# EAGLE schematic Atx_psu (EAGLE 5.10)
REV: 4

## Sheet 1 of 6
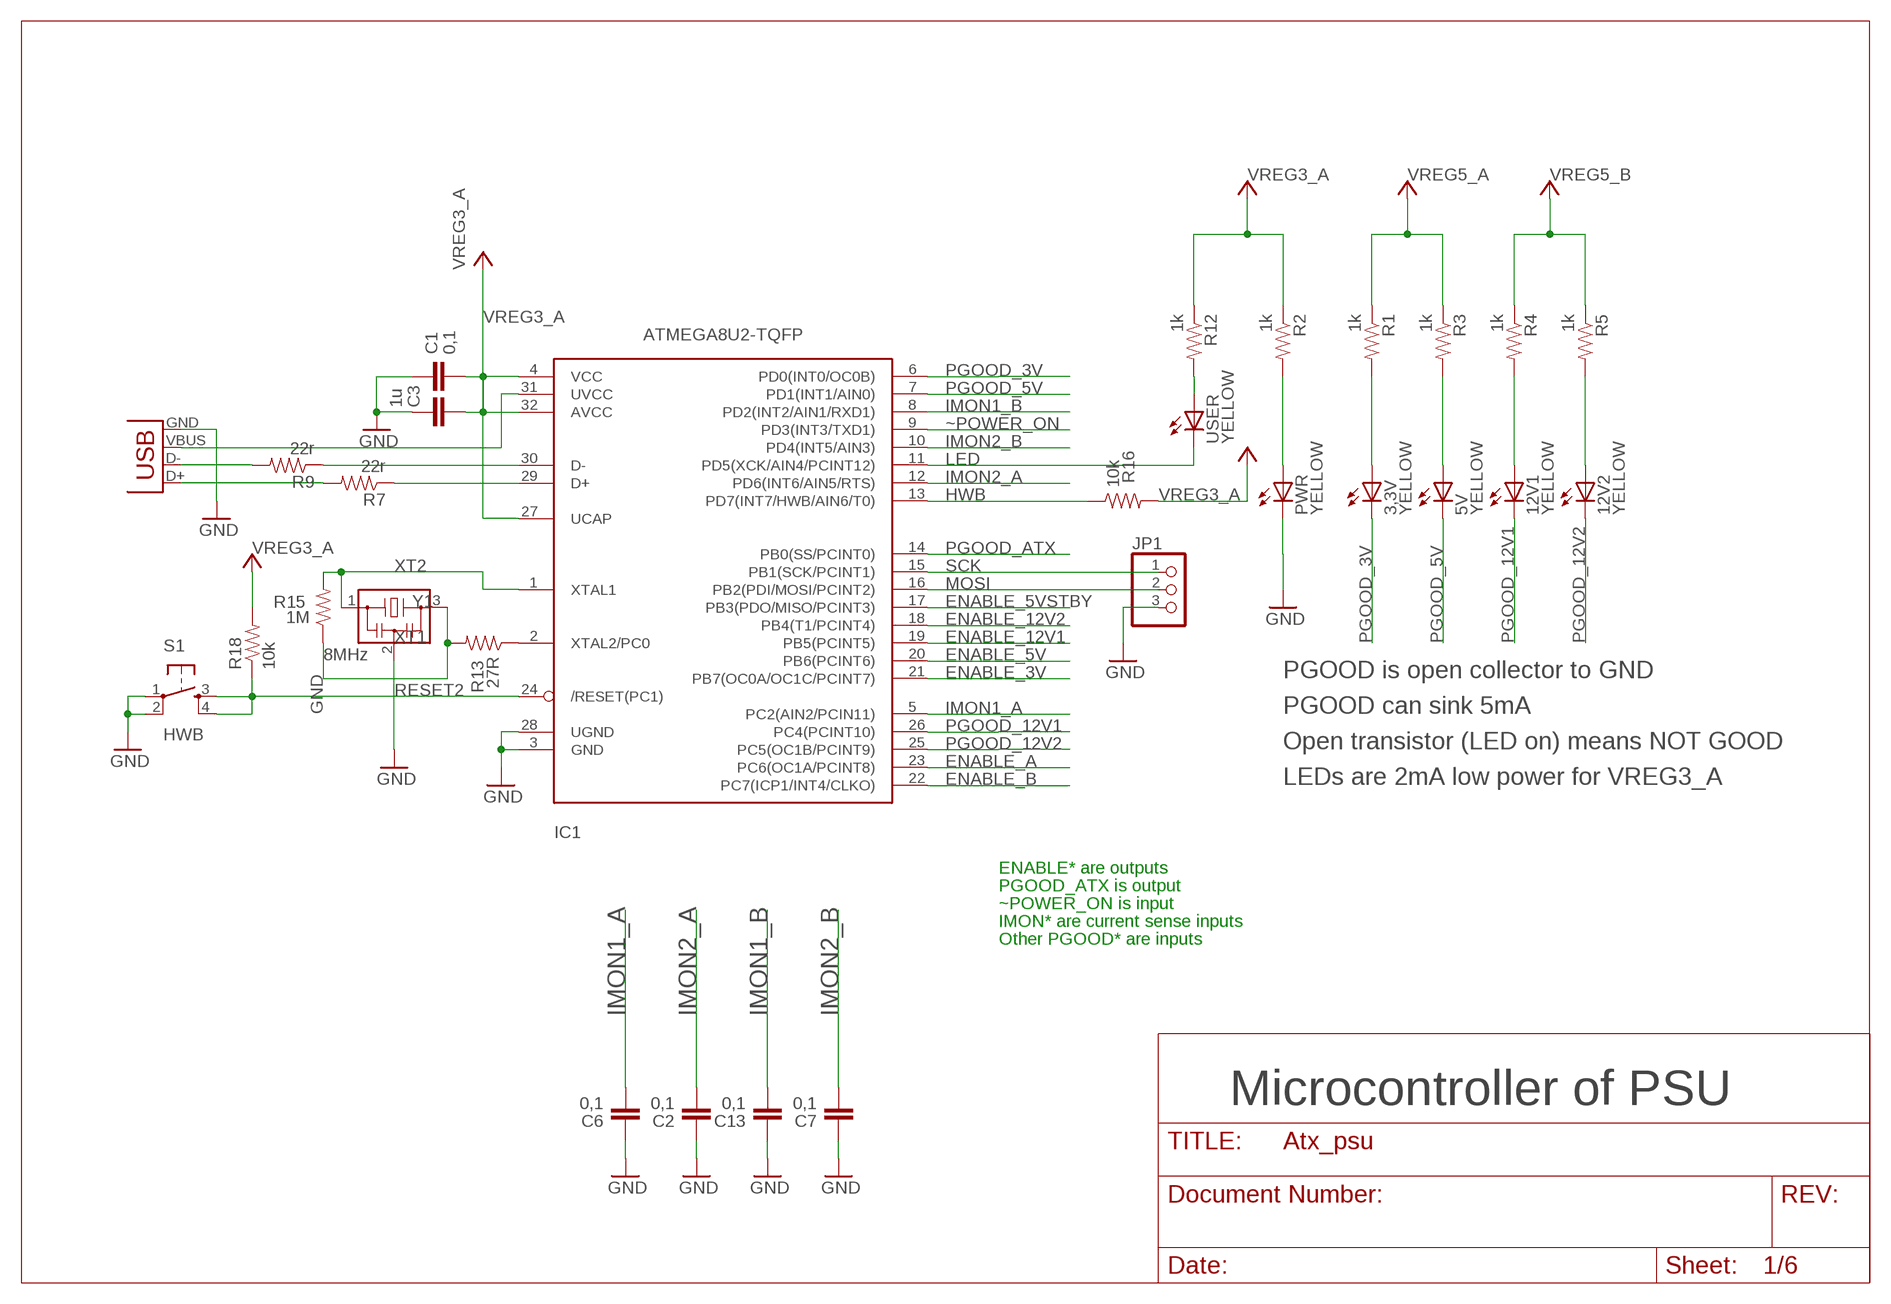
[diagram p0: schematic, sheet 1]

### Parts
3,3V  YELLOW  LEDCHIP-LED0805  [CHIP-LED0805]
5V  YELLOW  LEDCHIP-LED0805  [CHIP-LED0805]
12V1  YELLOW  LEDCHIP-LED0805  [CHIP-LED0805]
12V2  YELLOW  LEDCHIP-LED0805  [CHIP-LED0805]
C1  0,1  C-EUC0805K  [C0805K]
C2  0,1  C-EUC0805K  [C0805K]
C3  1u  C-EUC0805K  [C0805K]
C6  0,1  C-EUC0805K  [C0805K]
C7  0,1  C-EUC0805K  [C0805K]
C13  0,1  C-EUC0805K  [C0805K]
IC1  ATMEGA8U2-TQFP  ATMEGA32U2-TQFP  [TQFP32-08]
JP1  PINHD-1X3  [1X03]
PWR  YELLOW  LEDCHIP-LED0805  [CHIP-LED0805]
R1  1k  RESISTOR  [0805]
R2  1k  RESISTOR  [0805]
R3  1k  RESISTOR  [0805]
R4  1k  RESISTOR  [0805]
R5  1k  RESISTOR  [0805]
R7  22r  RESISTOR  [0805]
R9  22r  RESISTOR  [0805]
R12  1k  RESISTOR  [0805]
R13  27R  RESISTOR  [0805]
R15  1M  RESISTOR  [0805]
R16  10k  RESISTOR  [0805]
R18  10k  RESISTOR  [0805]
S1  HWB  TAC_SWITCHSMD  [TACTILE_SWITCH_SMD]
USER  YELLOW  LEDCHIP-LED0805  [CHIP-LED0805]
X2  USBSMD  [USB-MINIB]
Y1  8MHz  CSTCR6M00G53Z  [CSTCR6M]

### Nets
D+: R7.2 X2.D+
D-: R9.2 X2.D-
ENABLE_3V: IC1.21(PB7(OC0A/OC1C/PCINT7)) ; also sheet 2
ENABLE_5V: IC1.20(PB6(PCINT6)) ; also sheet 2
ENABLE_5VSTBY: IC1.17(PB3(PDO/MISO/PCINT3)) ; also sheet 4
ENABLE_12V1: IC1.19(PB5(PCINT5)) ; also sheet 3
ENABLE_12V2: IC1.18(PB4(T1/PCINT4)) ; also sheet 3
ENABLE_A: IC1.23(PC6(OC1A/PCINT8)) ; also sheet 2
ENABLE_B: IC1.22(PC7(ICP1/INT4/CLKO)) ; also sheet 3
GND: C1.2 C2.2 C3.2 C6.2 C7.2 C13.2 IC1.3(GND) IC1.28(UGND) JP1.3 PWR.C S1.1 S1.2 X2.GND Y1.2 ; also sheet 2,3,6
HWB: IC1.13(PD7(INT7/HWB/AIN6/T0)) R16.1
IMON1_A: C6.1 IC1.5(PC2(AIN2/PCIN11)) ; also sheet 2
IMON1_B: C13.1 IC1.8(PD2(INT2/AIN1/RXD1)) ; also sheet 3
IMON2_A: C2.1 IC1.12(PD6(INT6/AIN5/RTS)) ; also sheet 2
IMON2_B: C7.1 IC1.10(PD4(INT5/AIN3)) ; also sheet 3
LED: IC1.11(PD5(XCK/AIN4/PCINT12)) USER.C
MOSI: IC1.16(PB2(PDI/MOSI/PCINT2)) JP1.2
N$7: PWR.A R2.2
N$9: 3,3V.A R1.2
N$10: 5V.A R3.2
N$11: 12V1.A R4.2
N$14: 12V2.A R5.2
N$25: IC1.2(XTAL2/PC0) R13.1
N$36: R12.2 USER.A
PGOOD_3V: 3,3V.C IC1.6(PD0(INT0/OC0B)) ; also sheet 2
PGOOD_5V: 5V.C IC1.7(PD1(INT1/AIN0)) ; also sheet 2
PGOOD_12V1: 12V1.C IC1.26(PC4(PCINT10)) ; also sheet 3
PGOOD_12V2: 12V2.C IC1.25(PC5(OC1B/PCINT9)) ; also sheet 3
PGOOD_ATX [somepower]: IC1.14(PB0(SS/PCINT0)) ; also sheet 6
RD+: IC1.29(D+) R7.1
RD-: IC1.30(D-) R9.1
RESET2: IC1.24(/RESET(PC1)) R18.1 S1.3 S1.4
SCK: IC1.15(PB1(SCK/PCINT1)) JP1.1
USBVCC: IC1.31(UVCC) X2.VBUS
VREG3_A: C1.1 C3.1 IC1.4(VCC) IC1.27(UCAP) IC1.32(AVCC) R2.1 R12.1 R16.2 R18.2 ; supply symbol labelled +5V_L ; also sheet 2
VREG5_A: R1.1 R3.1 ; supply symbol labelled +5V_L ; also sheet 2
VREG5_B: R4.1 R5.1 ; supply symbol labelled +5V_L ; also sheet 3
XT1: R13.2 R15.1 Y1.3
XT2: IC1.1(XTAL1) R15.2 Y1.1
~POWER_ON [somepower]: IC1.9(PD3(INT3/TXD1)) ; also sheet 6

### Notes on the sheet
- PGOOD is open collector to GND
- PGOOD can sink 5mA
- Open transistor (LED on) means NOT GOOD
- LEDs are 2mA low power for VREG3_A
- ENABLE* are outputs
- PGOOD_ATX is output
- ~POWER_ON is input
- IMON* are current sense inputs
- Other PGOOD* are inputs
- Microcontroller of PSU

## Sheet 2 of 6
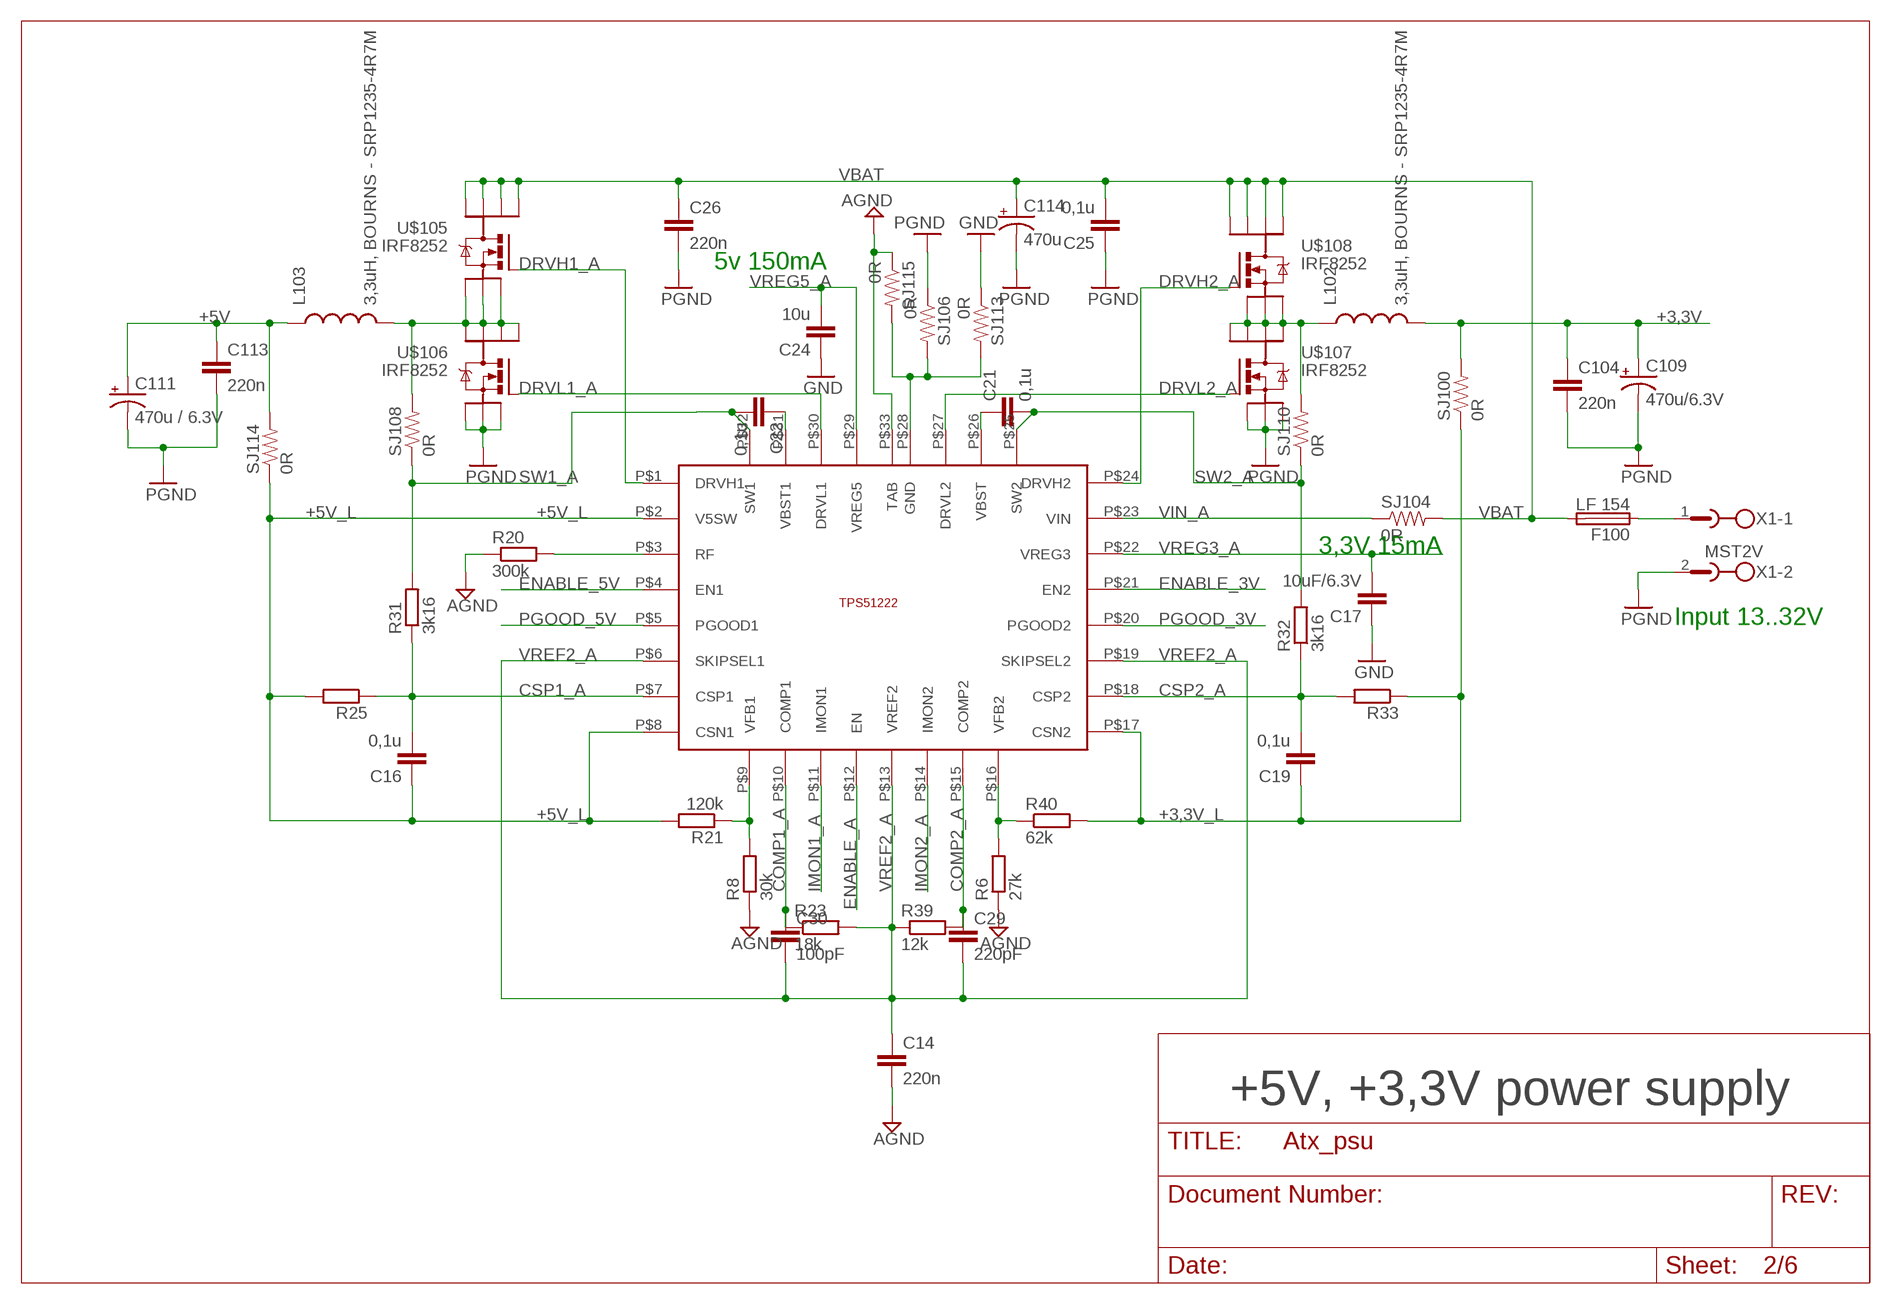
[diagram p1: schematic, sheet 2]

### Parts
C14  220n  C-EUC0603  [C0603]
C16  0,1u  C-EUC0805K  [C0805K]
C17  10uF/6.3V  C-EUC1210  [C1210]
C19  0,1u  C-EUC0805K  [C0805K]
C21  0,1u  C-EUC0805K  [C0805K]
C22  0,1u  C-EUC0805K  [C0805K]
C24  10u  C-EUC1210  [C1210]
C25  0,1u  C-EUC0805  [C0805]
C26  220n  C-EUC0603  [C0603]
C29  220pF  CAP0805  [0805]
C30  100pF  CAP0805  [0805]
C104  220n  C-EUC0805K  [C0805K]
C109  470u/6.3V  CAP_POLH13  [PANASONIC_H13]
C111  470u / 6.3V  CAP_POLH13  [PANASONIC_H13]
C113  220n  C-EUC0805K  [C0805K]
C114  470u  CAP_POLH13  [PANASONIC_H13]
F100  LF 154  FUSE  [OMNI-BLOK]
L102  3,3uH, BOURNS - SRP1235-4R7M  INDUCTORPWR  [CDRH125]
L103  3,3uH, BOURNS - SRP1235-4R7M  INDUCTORPWR  [CDRH125]
R6  27k  R-EU_R0805  [R0805]
R8  30k  R-EU_R0805  [R0805]
R20  300k  R-EU_R0805  [R0805]
R21  120k  R-EU_R0805  [R0805]
R23  18k  R-EU_R0805  [R0805]
R25  R-EU_R0805  [R0805]
R31  3k16  R-EU_R0805  [R0805]
R32  3k16  R-EU_R0805  [R0805]
R33  R-EU_R0805  [R0805]
R39  12k  R-EU_R0805  [R0805]
R40  62k  R-EU_R0805  [R0805]
SJ100  0R  RESISTOR1206  [1206]
SJ104  0R  RESISTOR1206  [1206]
SJ106  0R  RESISTOR1206  [1206]
SJ108  0R  RESISTOR1206  [1206]
SJ110  0R  RESISTOR1206  [1206]
SJ113  0R  RESISTOR1206  [1206]
SJ114  0R  RESISTOR1206  [1206]
SJ115  0R  RESISTOR1206  [1206]
U$2  TPS51222RTVT  [QFN-32]
U$105  IRF8252  [SO8]
U$106  IRF8252  [SO8]
U$107  IRF8252  [SO8]
U$108  IRF8252  [SO8]
X1  MST2V  [MSTBV2]

### Nets
+3,3V [power]: C104.1 C109.+ L102.2 SJ100.2 ; also sheet 6
+3,3V_L: C19.1 R33.1 R40.2 SJ100.1 U$2.P$17(CSN2)
+5V [power]: C111.+ C113.1 L103.1 SJ114.2 ; also sheet 6
+5V_L: C16.1 R21.2 R25.2 SJ114.1 U$2.P$2(V5SW) U$2.P$8(CSN1) ; also sheet 3
AGND: C14.2 R6.1 R8.1 R20.1 SJ115.1 U$2.P$33(TAB) ; also sheet 3
COMP1_A: C30.1 R23.1 U$2.P$10(COMP1)
COMP2_A: C29.1 R39.2 U$2.P$15(COMP2)
CSP1_A: C16.2 R25.1 R31.1 U$2.P$7(CSP1)
CSP2_A: C19.2 R32.1 R33.2 U$2.P$18(CSP2)
DRVH1_A: U$2.P$1(DRVH1) U$105.4(G)
DRVH2_A: U$2.P$24(DRVH2) U$108.4(G)
DRVL1_A: U$2.P$30(DRVL1) U$106.4(G)
DRVL2_A: U$2.P$27(DRVL2) U$107.4(G)
ENABLE_3V: U$2.P$21(EN2) ; also sheet 1
ENABLE_5V: U$2.P$4(EN1) ; also sheet 1
ENABLE_A: U$2.P$12(EN) ; also sheet 1
GND: C17.1 C24.1 SJ113.1 ; also sheet 1,3,6
IMON1_A: U$2.P$11(IMON1) ; also sheet 1
IMON2_A: U$2.P$14(IMON2) ; also sheet 1
N$1: SJ106.2 SJ113.2 SJ115.2 U$2.P$28(GND)
N$2 [power]: L102.1 SJ110.2 U$107.5(D) U$107.6(D) U$107.7(D) U$107.8(D) U$108.1(S) U$108.2(S) U$108.3(S)
N$3: R8.2 R21.1 U$2.P$9(VFB1)
N$4: R6.2 R40.1 U$2.P$16(VFB2)
N$8 [power]: L103.2 SJ108.2 U$105.1(S) U$105.2(S) U$105.3(S) U$106.5(D) U$106.6(D) U$106.7(D) U$106.8(D)
N$16 [power]: F100.1 X1.1
N$24: R20.2 U$2.P$3(RF)
N$29: C22.1 U$2.P$31(VBST1)
N$30: C21.1 U$2.P$26(VBST)
PGND [power]: C25.1 C26.2 C104.2 C109.- C111.- C113.2 C114.- SJ106.1 U$106.1(S) U$106.2(S) U$106.3(S) U$107.1(S) U$107.2(S) U$107.3(S) X1.2 ; also sheet 3,4,5,6
PGOOD_3V: U$2.P$20(PGOOD2) ; also sheet 1
PGOOD_5V: U$2.P$5(PGOOD1) ; also sheet 1
SW1_A: C22.2 R31.2 SJ108.1 U$2.P$32(SW1)
SW2_A: C21.2 R32.2 SJ110.1 U$2.P$25(SW2)
VBAT [power]: C25.2 C26.1 C114.+ F100.2 SJ104.2 U$105.5(D) U$105.6(D) U$105.7(D) U$105.8(D) U$108.5(D) U$108.6(D) U$108.7(D) U$108.8(D) ; also sheet 3,4
VIN_A: SJ104.1 U$2.P$23(VIN)
VREF2_A: C14.1 C29.2 C30.2 R23.2 R39.1 U$2.P$6(SKIPSEL1) U$2.P$13(VREF2) U$2.P$19(SKIPSEL2)
VREG3_A: C17.2 U$2.P$22(VREG3) ; also sheet 1
VREG5_A: C24.2 U$2.P$29(VREG5) ; also sheet 1

### Notes on the sheet
- 5v 150mA
- 3,3V 15mA
- Input 13..32V
- +5V, +3,3V power supply

## Sheet 3 of 6
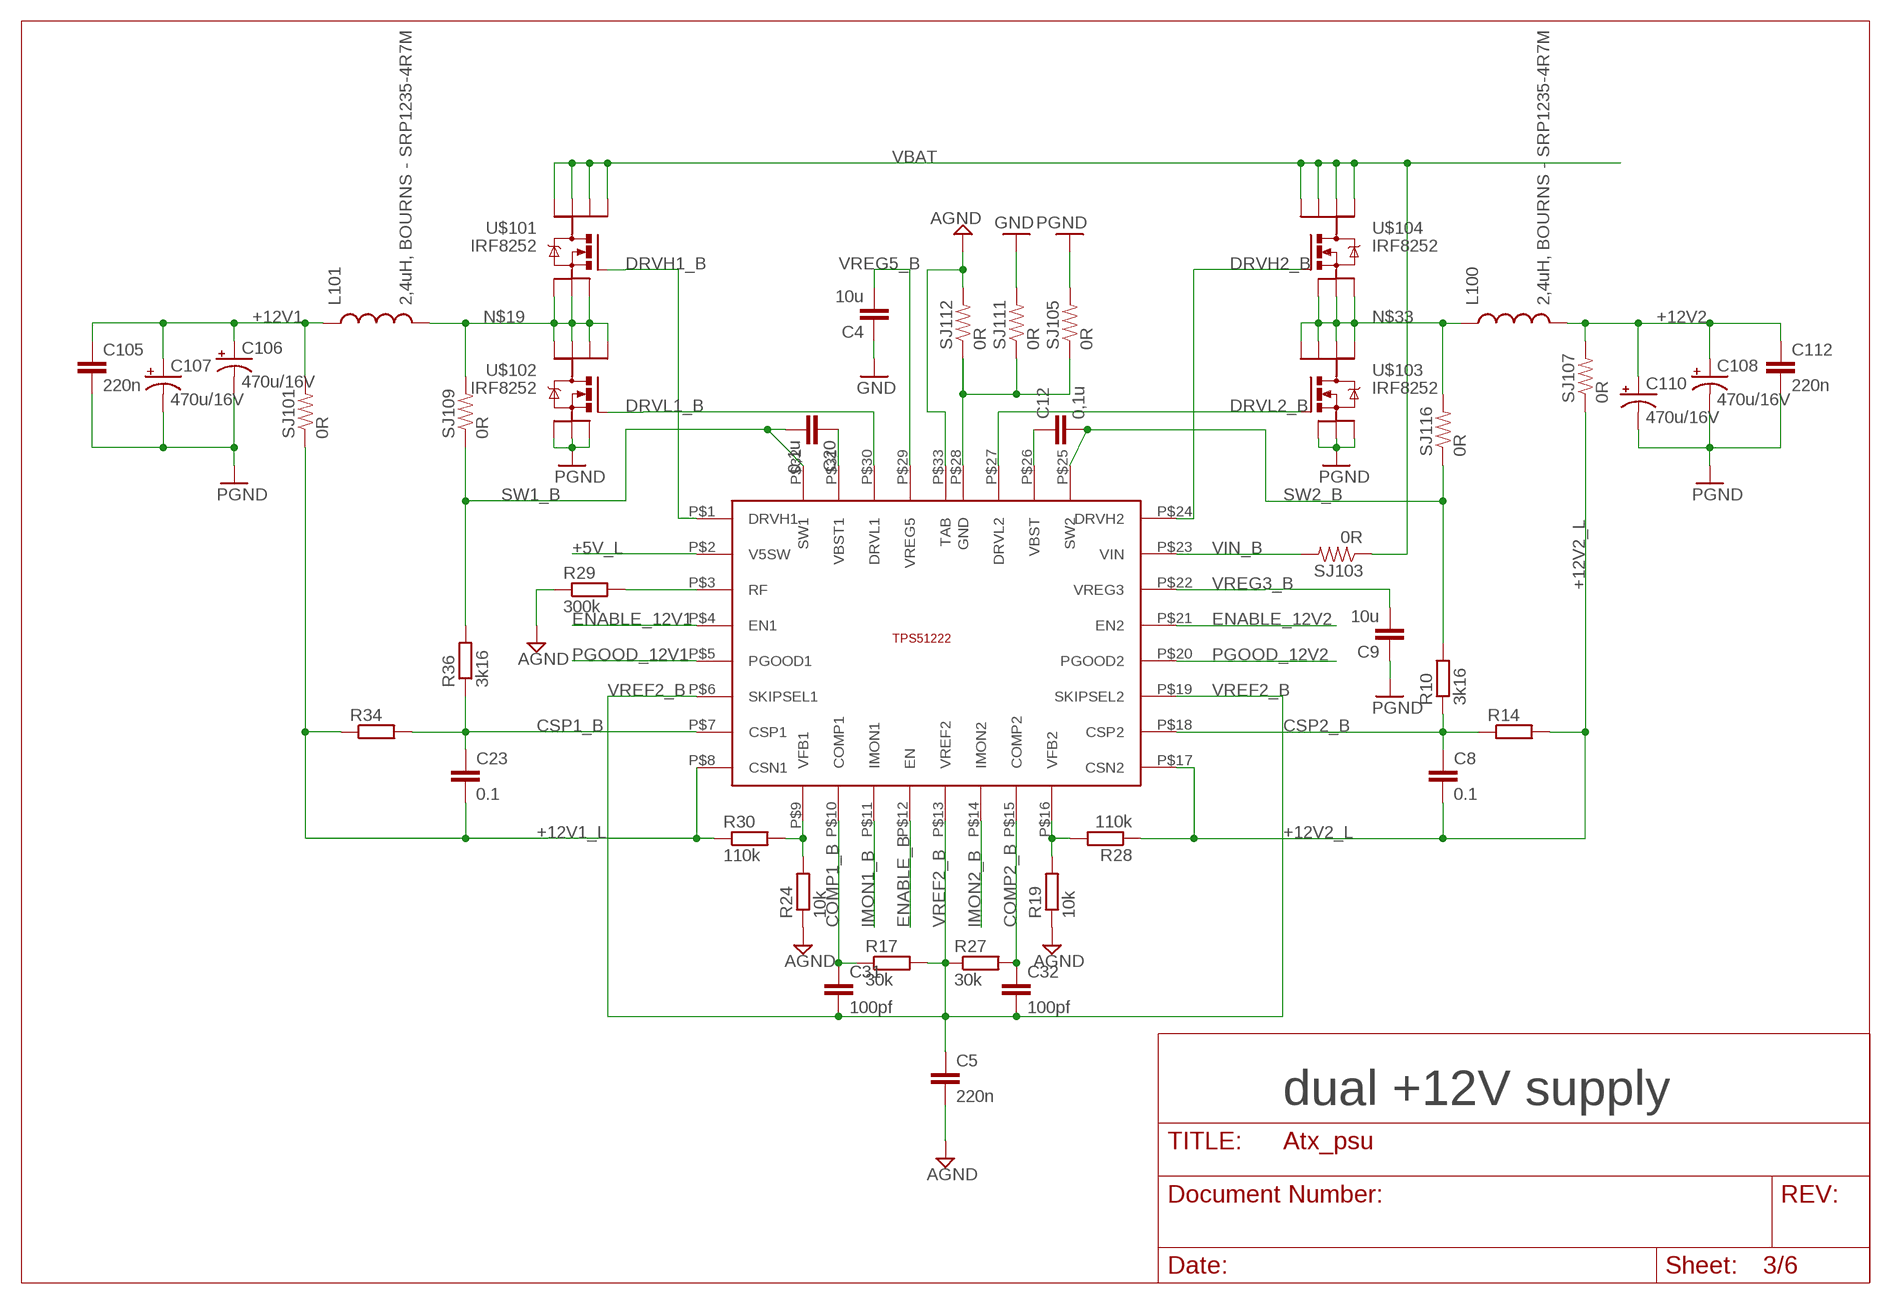
[diagram p2: schematic, sheet 3]

### Parts
C4  10u  C-EUC1210  [C1210]
C5  220n  C-EUC0805K  [C0805K]
C8  0.1  C-EUC0805K  [C0805K]
C9  10u  C-EUC1210  [C1210]
C12  0,1u  C-EUC0805K  [C0805K]
C20  0,1u  C-EUC0805K  [C0805K]
C23  0.1  C-EUC0805K  [C0805K]
C31  100pf  CAP0805  [0805]
C32  100pf  CAP0805  [0805]
C105  220n  C-EUC0805K  [C0805K]
C106  470u/16V  CAP_POLH13  [PANASONIC_H13]
C107  470u/16V  CAP_POLH13  [PANASONIC_H13]
C108  470u/16V  CAP_POLH13  [PANASONIC_H13]
C110  470u/16V  CAP_POLH13  [PANASONIC_H13]
C112  220n  C-EUC0805K  [C0805K]
L100  2,4uH, BOURNS - SRP1235-4R7M  INDUCTORPWR  [CDRH125]
L101  2,4uH, BOURNS - SRP1235-4R7M  INDUCTORPWR  [CDRH125]
R10  3k16  R-EU_R0805  [R0805]
R14  R-EU_R0805  [R0805]
R17  30k  R-EU_R0805  [R0805]
R19  10k  R-EU_R0805  [R0805]
R24  10k  R-EU_R0805  [R0805]
R27  30k  R-EU_R0805  [R0805]
R28  110k  R-EU_R0805  [R0805]
R29  300k  R-EU_R0805  [R0805]
R30  110k  R-EU_R0805  [R0805]
R34  R-EU_R0805  [R0805]
R36  3k16  R-EU_R0805  [R0805]
SJ101  0R  RESISTOR1206  [1206]
SJ103  0R  RESISTOR1206  [1206]
SJ105  0R  RESISTOR1206  [1206]
SJ107  0R  RESISTOR1206  [1206]
SJ109  0R  RESISTOR1206  [1206]
SJ111  0R  RESISTOR1206  [1206]
SJ112  0R  RESISTOR1206  [1206]
SJ116  0R  RESISTOR1206  [1206]
U$1  TPS51222RTVT  [QFN-32]
U$101  IRF8252  [SO8]
U$102  IRF8252  [SO8]
U$103  IRF8252  [SO8]
U$104  IRF8252  [SO8]

### Nets
+5V_L: U$1.P$2(V5SW) ; also sheet 2
+12V1 [power]: C105.1 C106.+ C107.+ L101.1 SJ101.2 ; also sheet 5,6
+12V1_L: C23.2 R30.1 R34.1 SJ101.1 U$1.P$8(CSN1)
+12V2 [power]: C108.+ C110.+ C112.1 L100.2 SJ107.2 ; also sheet 6
+12V2_L: C8.2 R14.2 R28.1 SJ107.1 U$1.P$17(CSN2)
AGND: C5.2 R19.1 R24.1 R29.1 SJ112.2 U$1.P$33(TAB) ; also sheet 2
COMP1_B: C31.1 R17.1 U$1.P$10(COMP1)
COMP2_B: C32.1 R27.2 U$1.P$15(COMP2)
CSP1_B: C23.1 R34.2 R36.1 U$1.P$7(CSP1)
CSP2_B: C8.1 R10.1 R14.1 U$1.P$18(CSP2)
DRVH1_B: U$1.P$1(DRVH1) U$101.4(G)
DRVH2_B: U$1.P$24(DRVH2) U$104.4(G)
DRVL1_B: U$1.P$30(DRVL1) U$102.4(G)
DRVL2_B: U$1.P$27(DRVL2) U$103.4(G)
ENABLE_12V1: U$1.P$4(EN1) ; also sheet 1
ENABLE_12V2: U$1.P$21(EN2) ; also sheet 1
ENABLE_B: U$1.P$12(EN) ; also sheet 1
GND: C4.1 C9.1 SJ111.2 ; supply symbol labelled PGND ; also sheet 1,2,6
IMON1_B: U$1.P$11(IMON1) ; also sheet 1
IMON2_B: U$1.P$14(IMON2) ; also sheet 1
N$12: R29.2 U$1.P$3(RF)
N$13: C20.1 U$1.P$31(VBST1)
N$15: C12.1 U$1.P$26(VBST)
N$19 [power]: L101.2 SJ109.2 U$101.1(S) U$101.2(S) U$101.3(S) U$102.5(D) U$102.6(D) U$102.7(D) U$102.8(D)
N$33 [power]: L100.1 SJ116.2 U$103.5(D) U$103.6(D) U$103.7(D) U$103.8(D) U$104.1(S) U$104.2(S) U$104.3(S)
N$41: R24.2 R30.2 U$1.P$9(VFB1)
N$42: R19.2 R28.2 U$1.P$16(VFB2)
N$61: SJ105.1 SJ111.1 SJ112.1 U$1.P$28(GND)
PGND [power]: C105.2 C106.- C107.- C108.- C110.- C112.2 SJ105.2 U$102.1(S) U$102.2(S) U$102.3(S) U$103.1(S) U$103.2(S) U$103.3(S) ; also sheet 2,4,5,6
PGOOD_12V1: U$1.P$5(PGOOD1) ; also sheet 1
PGOOD_12V2: U$1.P$20(PGOOD2) ; also sheet 1
SW1_B: C20.2 R36.2 SJ109.1 U$1.P$32(SW1)
SW2_B: C12.2 R10.2 SJ116.1 U$1.P$25(SW2)
VBAT [power]: SJ103.1 U$101.5(D) U$101.6(D) U$101.7(D) U$101.8(D) U$104.5(D) U$104.6(D) U$104.7(D) U$104.8(D) ; also sheet 2,4
VIN_B: SJ103.2 U$1.P$23(VIN)
VREF2_B: C5.1 C31.2 C32.2 R17.2 R27.1 U$1.P$6(SKIPSEL1) U$1.P$13(VREF2) U$1.P$19(SKIPSEL2)
VREG3_B: C9.2 U$1.P$22(VREG3)
VREG5_B: C4.2 U$1.P$29(VREG5) ; also sheet 1

### Notes on the sheet
- dual +12V supply

## Sheet 4 of 6
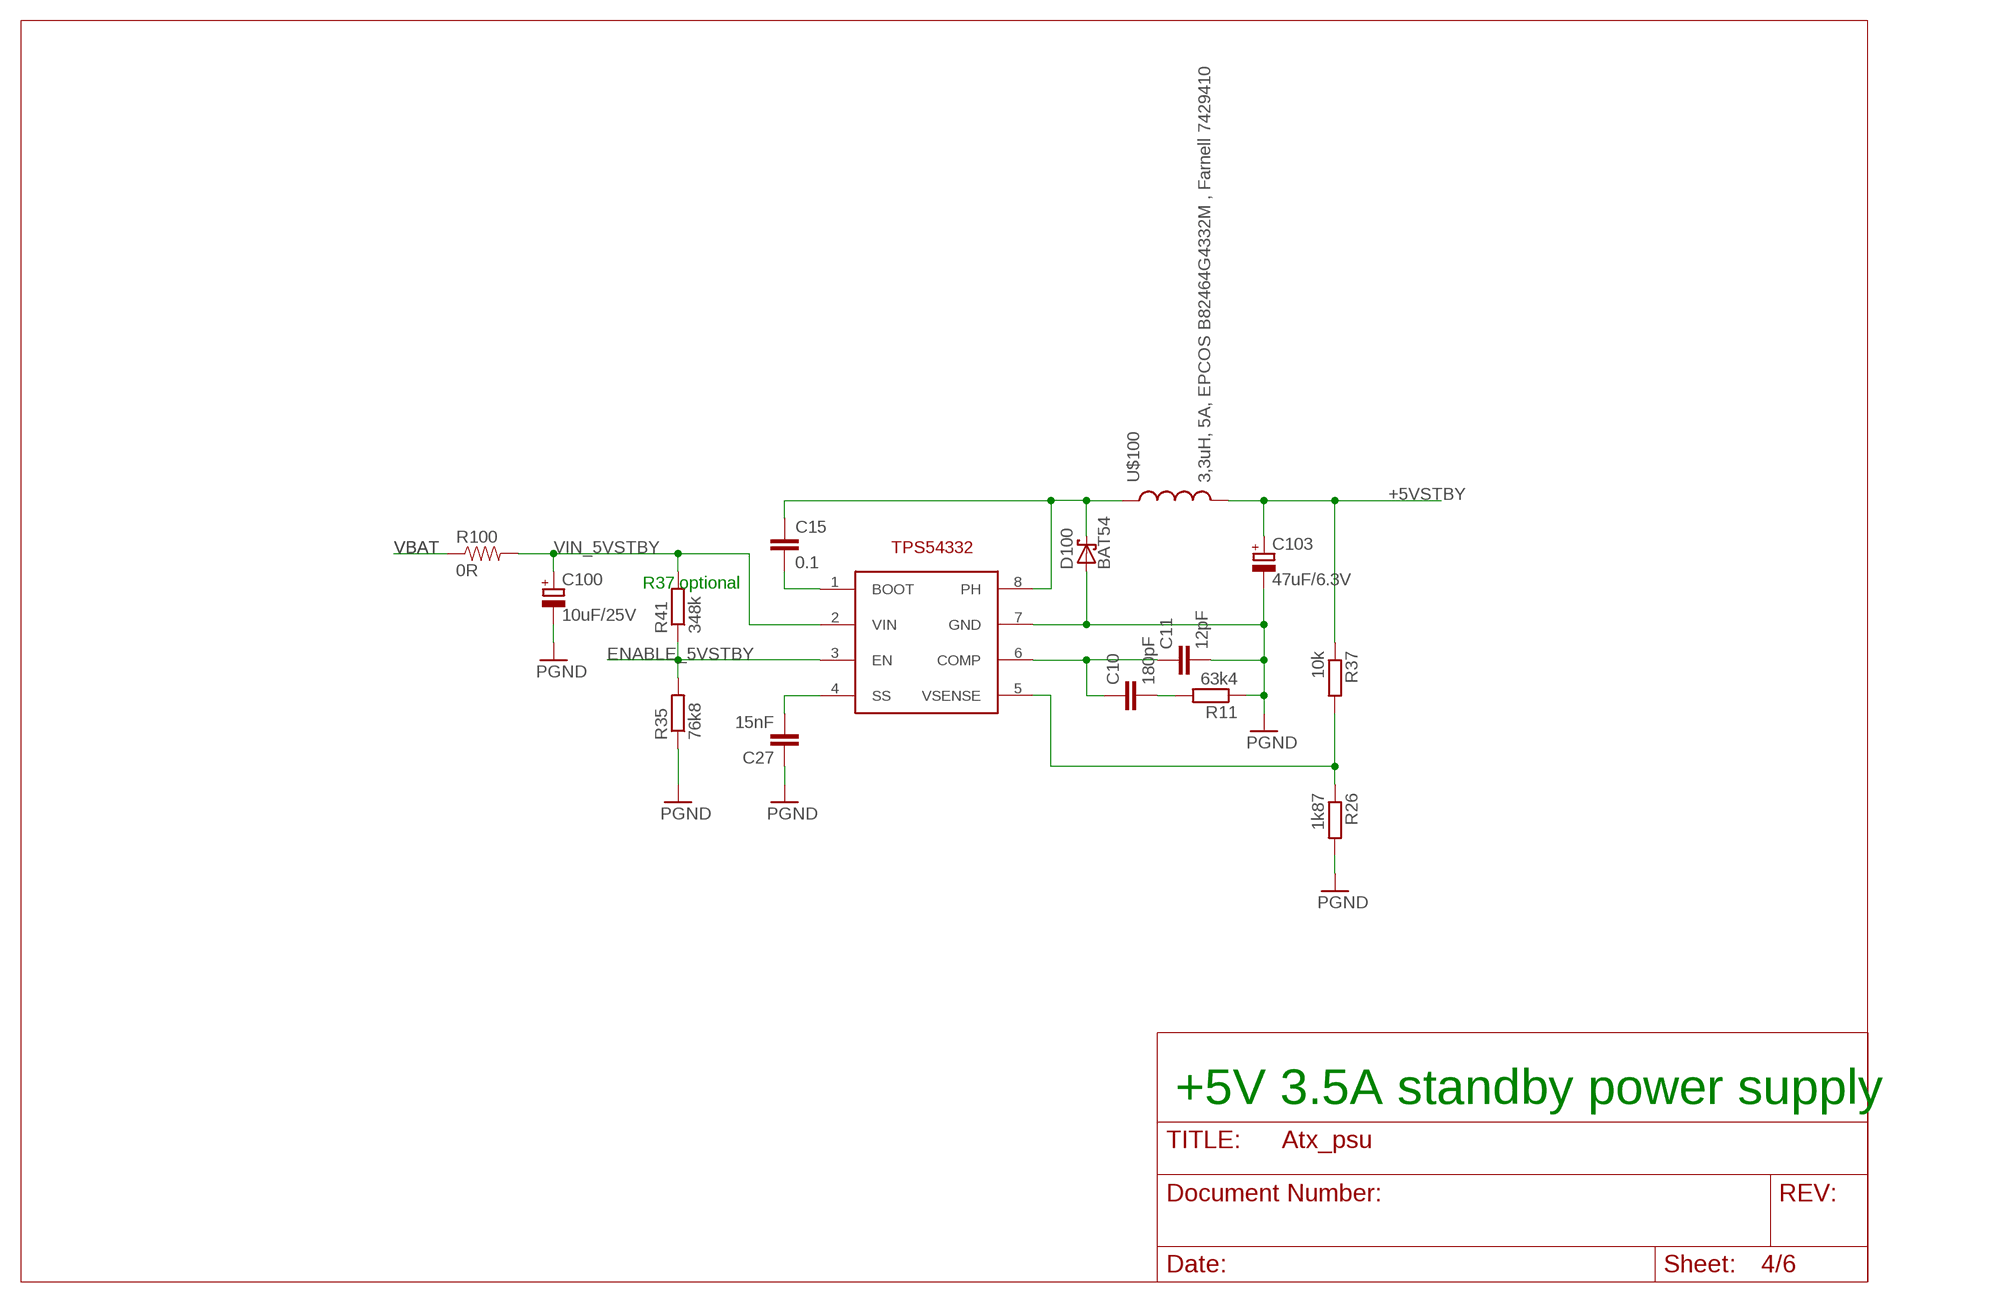
[diagram p3: schematic, sheet 4]

### Parts
C10  180pF  C-EUC0805K  [C0805K]
C11  12pF  C-EUC0805K  [C0805K]
C15  0.1  C-EUC0805K  [C0805K]
C27  15nF  C-EUC0805K  [C0805K]
C100  10uF/25V  CPOL-EU153CLV-0807  [153CLV-0807]
C103  47uF/6.3V  CPOL-EU153CLV-0807  [153CLV-0807]
D100  BAT54  [SOT23]
R11  63k4  R-EU_R0805  [R0805]
R26  1k87  R-EU_R0805  [R0805]
R35  76k8  R-EU_R0805  [R0805]
R37  10k  R-EU_R0805  [R0805]
R41  348k  R-EU_R0805  [R0805]
R100  0R  RESISTOR1206  [1206]
U$3  TPS54332  [SO8]
U$100  3,3uH, 5A, EPCOS B82464G4332M , Farnell 7429410  INDUCTORCR75  [CR75]

### Nets
+5VSTBY [somepower]: C103.+ R37.1 U$100.P$2 ; also sheet 6
ENABLE_5VSTBY: R35.2 R41.1 U$3.3(EN) ; also sheet 1
N$20: C27.2 U$3.4(SS)
N$22 [somepower]: C15.1 D100.3(C) U$3.8(PH) U$100.P$1
N$28: C10.1 C11.1 U$3.6(COMP)
N$31: C10.2 R11.2
N$35: C15.2 U$3.1(BOOT)
N$43: R26.1 R37.2 U$3.5(VSENSE)
PGND [power]: C11.2 C27.1 C100.- C103.- D100.1(A) R11.1 R26.2 R35.1 U$3.7(GND) ; also sheet 2,3,5,6
VBAT [power]: R100.1 ; also sheet 2,3
VIN_5VSTBY [somepower]: C100.+ R41.2 R100.2 U$3.2(VIN)

### Notes on the sheet
- R37 optional
- +5V 3.5A standby power supply

## Sheet 5 of 6
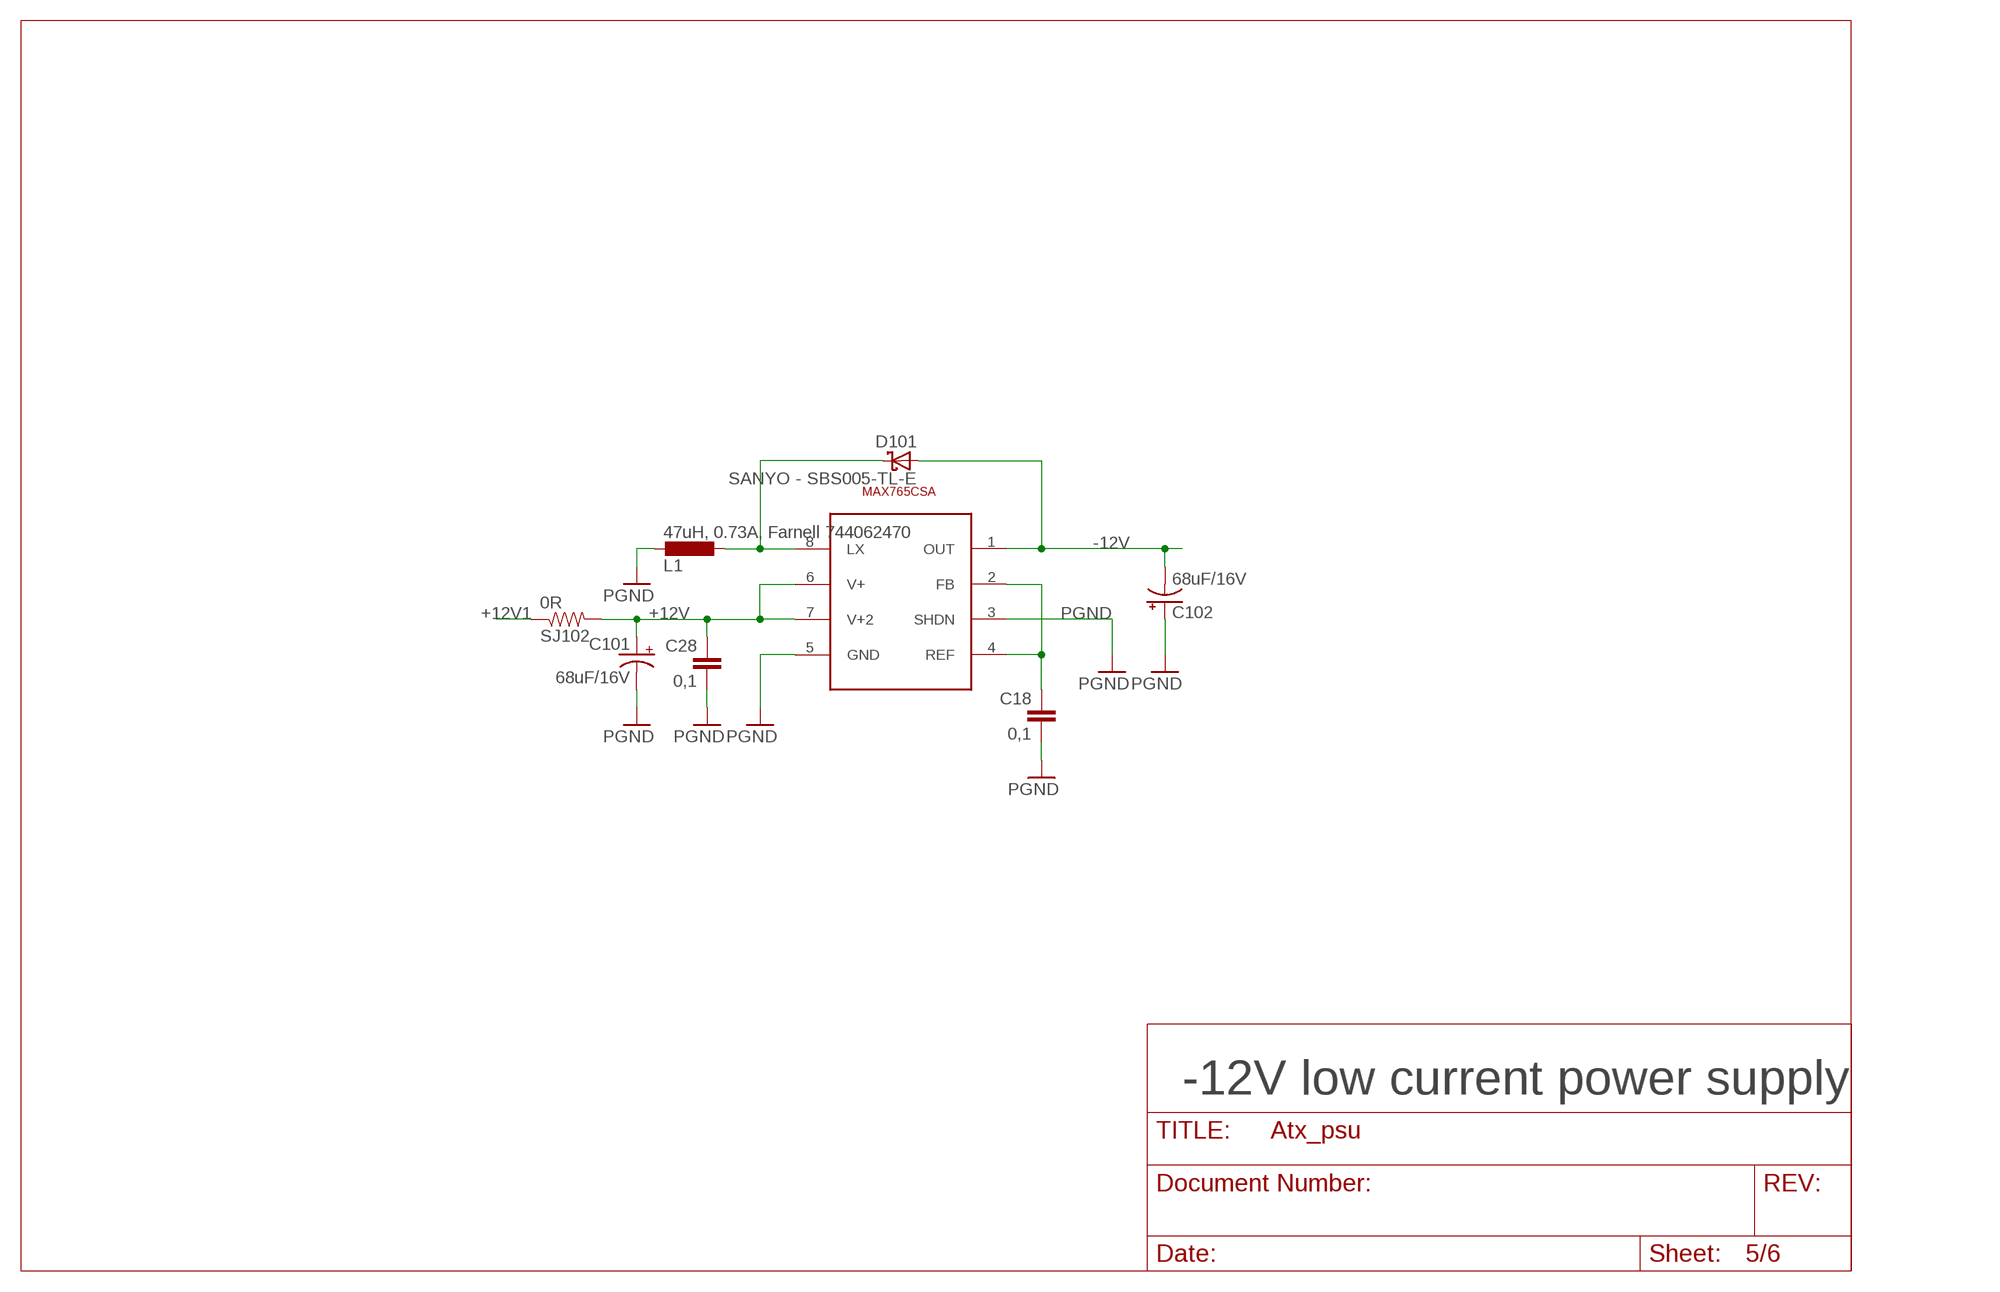
[diagram p4: schematic, sheet 5]

### Parts
C18  0,1  C-EUC0805K  [C0805K]
C28  0,1  C-EUC0805K  [C0805K]
C101  68uF/16V  CAP_POLE  [PANASONIC_E]
C102  68uF/16V  CAP_POLE  [PANASONIC_E]
D101  SANYO - SBS005-TL-E  BAT54  [SOT23]
L1  47uH, 0.73A, Farnell 744062470  L-EUWE-TPC  [POWER-CHOKE_WE-TPC]
SJ102  0R  RESISTOR1206  [1206]
U$4  MAX765CSA  [SO8]

### Nets
+12V [somepower]: C28.1 C101.+ SJ102.2 U$4.6(V+) U$4.7(V+2)
+12V1 [power]: SJ102.1 ; also sheet 3,6
-12V [somepower]: C102.- D101.1(A) U$4.1(OUT) ; also sheet 6
N$5: C18.1 U$4.2(FB) U$4.4(REF)
N$6 [somepower]: D101.3(C) L1.1 U$4.8(LX)
PGND [power]: C18.2 C28.2 C101.- C102.+ L1.2 U$4.3(SHDN) U$4.5(GND) ; also sheet 2,3,4,6

### Notes on the sheet
- -12V low current power supply

## Sheet 6 of 6
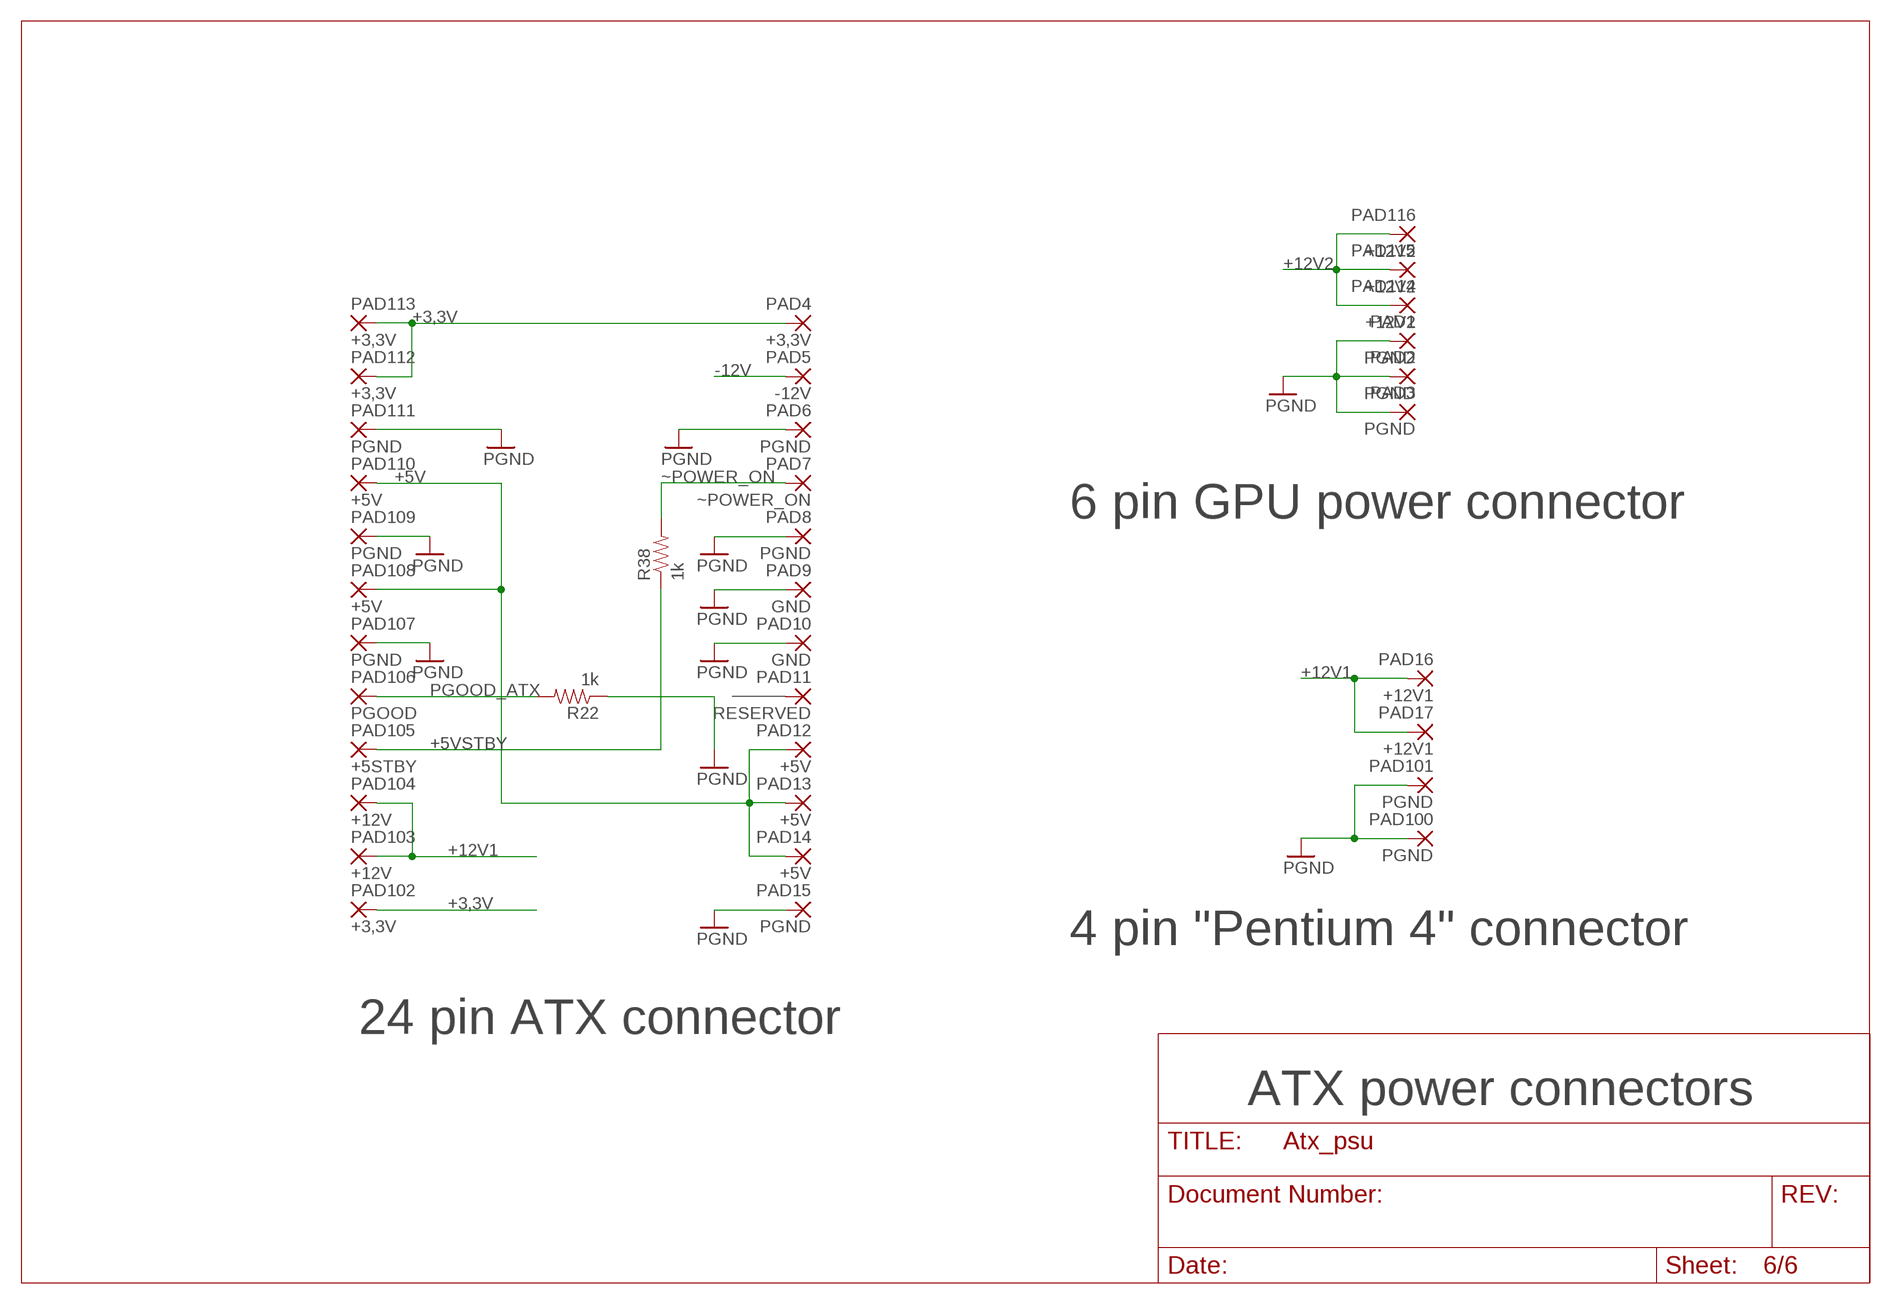
[diagram p5: schematic, sheet 6]

### Parts
PAD1  PGND  SMD5  [SMD2,54-5,08]
PAD2  PGND  SMD5  [SMD2,54-5,08]
PAD3  PGND  SMD5  [SMD2,54-5,08]
PAD4  +3,3V  SMD5  [SMD2,54-5,08]
PAD5  -12V  SMD5  [SMD2,54-5,08]
PAD6  PGND  SMD5  [SMD2,54-5,08]
PAD7  ~POWER_ON  SMD5  [SMD2,54-5,08]
PAD8  PGND  SMD5  [SMD2,54-5,08]
PAD9  GND  SMD5  [SMD2,54-5,08]
PAD10  GND  SMD5  [SMD2,54-5,08]
PAD11  RESERVED  SMD5  [SMD2,54-5,08]
PAD12  +5V  SMD5  [SMD2,54-5,08]
PAD13  +5V  SMD5  [SMD2,54-5,08]
PAD14  +5V  SMD5  [SMD2,54-5,08]
PAD15  PGND  SMD5  [SMD2,54-5,08]
PAD16  +12V1  SMD5  [SMD2,54-5,08]
PAD17  +12V1  SMD5  [SMD2,54-5,08]
PAD100  PGND  SMD5  [SMD2,54-5,08]
PAD101  PGND  SMD5  [SMD2,54-5,08]
PAD102  +3,3V  SMD5  [SMD2,54-5,08]
PAD103  +12V  SMD5  [SMD2,54-5,08]
PAD104  +12V  SMD5  [SMD2,54-5,08]
PAD105  +5STBY  SMD5  [SMD2,54-5,08]
PAD106  PGOOD  SMD5  [SMD2,54-5,08]
PAD107  PGND  SMD5  [SMD2,54-5,08]
PAD108  +5V  SMD5  [SMD2,54-5,08]
PAD109  PGND  SMD5  [SMD2,54-5,08]
PAD110  +5V  SMD5  [SMD2,54-5,08]
PAD111  PGND  SMD5  [SMD2,54-5,08]
PAD112  +3,3V  SMD5  [SMD2,54-5,08]
PAD113  +3,3V  SMD5  [SMD2,54-5,08]
PAD114  +12V2  SMD5  [SMD2,54-5,08]
PAD115  +12V2  SMD5  [SMD2,54-5,08]
PAD116  +12V2  SMD5  [SMD2,54-5,08]
R22  1k  RESISTOR  [0805]
R38  1k  RESISTOR  [0805]

### Nets
+3,3V [power]: PAD4.1(P) PAD102.1(P) PAD112.1(P) PAD113.1(P) ; also sheet 2
+5V [power]: PAD12.1(P) PAD13.1(P) PAD14.1(P) PAD108.1(P) PAD110.1(P) ; also sheet 2
+5VSTBY [somepower]: PAD105.1(P) R38.1 ; also sheet 4
+12V1 [power]: PAD16.1(P) PAD17.1(P) PAD103.1(P) PAD104.1(P) ; also sheet 3,5
+12V2 [power]: PAD114.1(P) PAD115.1(P) PAD116.1(P) ; also sheet 3
-12V [somepower]: PAD5.1(P) ; also sheet 5
GND: R22.1 ; supply symbol labelled PGND ; also sheet 1,2,3
PGND [power]: PAD1.1(P) PAD2.1(P) PAD3.1(P) PAD6.1(P) PAD8.1(P) PAD9.1(P) PAD10.1(P) PAD15.1(P) PAD100.1(P) PAD101.1(P) PAD107.1(P) PAD109.1(P) PAD111.1(P) ; also sheet 2,3,4,5
PGOOD_ATX [somepower]: PAD106.1(P) R22.2 ; also sheet 1
~POWER_ON [somepower]: PAD7.1(P) R38.2 ; also sheet 1
Unconnected: PAD11.1(P)

### Notes on the sheet
- 6 pin GPU power connector
- 4 pin "Pentium 4" connector
- 24 pin ATX connector
- ATX power connectors

## Library data of the parts
3,3V 5V 12V1 12V2 PWR USER = led:LED: LED OSRAM: - CHIPLED LG R971, LG N971, LY N971, LG Q971, LY Q971, LO R971, LY R971 LH N974, LH R974 LS Q976, LO Q976, LY Q976 LO Q996 - Hyper CHIPLED LW Q18S LB Q993, LB Q99A, LB R99A - SideLED LS A670, LO A670, LY A670, LG A670, LP A670 LB A673, LV A673, LT A673, LW A673 LH A674 LY A675 LS A676, LA A676, LO A676, LY A676, LW A676 LS A679, LY A679, LG A679 - Hyper Micro SIDELED® LS Y876, LA Y876, LO Y876, LY Y876 LT Y87S - SmartLED LW L88C, LW L88S LB L89C, LB L89S, LG L890 LS L89K, LO L89K, LY L89K LS L896, LA L896, LO L896, LY L896 - TOPLED LS T670, LO T670, LY T670, LG T670, LP T670 LSG T670, LSP T670, LSY T670, LOP T670, LYG T670 LG T671, LOG T671, LSG T671 LB T673, LV T673, LT T673, LW T673 LH T674 LS T676, LA T676, LO T676, LY T676, LB T676, LH T676, LSB T676, LW T676 LB T67C, LV T67C, LT T67C, LS T67K, LO T67K, LY T67K, LW E67C LS E67B, LA E67B, LO E67B, LY E67B, LB E67C, LV E67C, LT E67C LW T67C LS T679, LY T679, LG T679 LS T770, LO T770, LY T770, LG T770, LP T770 LB T773, LV T773, LT T773, LW T773 LH T774 LS E675, LA E675, LY E675, LS T675 LS T776, LA T776, LO T776, LY T776, LB T776 LHGB T686 LT T68C, LB T68C - Hyper Mini TOPLED® LB M676 - Mini TOPLED Santana® LG M470 LS M47K, LO M47K, LY M47K Source: http://www.osram.convergy.de LUXEON: - LUMILED® LXK2-PW12-R00, LXK2-PW12-S00, LXK2-PW14-U00, LXK2-PW14-V00 LXK2-PM12-R00, LXK2-PM12-S00, LXK2-PM14-U00 LXK2-PE12-Q00, LXK2-PE12-R00, LXK2-PE12-S00, LXK2-PE14-T00, LXK2-PE14-U00 LXK2-PB12-K00, LXK2-PB12-L00, LXK2-PB12-M00, LXK2-PB14-N00, LXK2-PB14-P00, LXK2-PB14-Q00 LXK2-PR12-L00, LXK2-PR12-M00, LXK2-PR14-Q00, LXK2-PR14-R00 LXK2-PD12-Q00, LXK2-PD12-R00, LXK2-PD12-S00 LXK2-PH12-R00, LXK2-PH12-S00 LXK2-PL12-P00, LXK2-PL12-Q00, LXK2-PL12-R00 Source: www.luxeon.com KINGBRIGHT: KA-3528ASYC Source: www.kingbright.com
C1-C4 C6 C7 C9-C22 C24-C28 C104 C105 C112 C113 = rcl:C-EU: CAPACITOR, European symbol
C5 C8 C23 = resistor:C-EU: CAPACITOR, European symbol
C29-C32 = SparkFun:CAP: Capacitor Standard 0603 ceramic capacitor, and 0.1" leaded capacitor.
C100 C103 = resistor:CPOL-EU: POLARIZED CAPACITOR, European symbol
C101 C102 C106-C111 C114 = SparkFun:CAP_POL: Capacitor Polarized These are standard SMD and PTH capacitors. Normally 10uF, 47uF, and 100uF in electrolytic and tantalum varieties. Always verify the external diameter of the through hole cap, it varies with capacity, voltage, and manufacturer. The EIA devices should be standard.
D100 D101 = diode:BAT54: Schottky Diodes Source: Fairchild .. BAT54.pdf
F100 = fuse:FUSE: Fuse
IC1 = adafruit:ATMEGA32U2: ATmega32u2 Pin compatible with the atmega8u2, atmega16u2 and atmega32u2 8, 16 or 32 K flash, 1K RAM, 512b EEPROM 8 bit and 16 bit timer (5 PWM total) UART, SPI (no I2C!) USB with 4 endpoints, LUFA compatible 22 I/O lines, analog comparator (no ADC!) Comes with DFU bootloader burned in!
JP1 = adafruit:PINHD-1X3: PIN HEADER
L1 = rcl:L-EU: INDUCTOR, European symbol
L100-L103 U$100 = SparkFun:INDUCTOR: Inductors Basic Inductor/Choke - 0603 and 1206. Footprints are not proven and vary greatly between part numbers.
PAD1-PAD17 PAD100-PAD116 = wirepad:SMD5: SMD PAD
R1-R5 R7 R9 R12 R13 R15 R16 R18 R22 R38 R100 SJ100-SJ116 = SparkFun:RESISTOR: Resistor Basic schematic elements and footprints for 0603, 1206, and PTH 1/10th watt (small) resistors.
R6 R8 R20 R21 R23 R25 R29 R31-R33 R39 R40 = rcl:R-EU_: RESISTOR, European symbol
R10 R11 R14 R17 R19 R24 R26-R28 R30 R34-R37 R41 = resistor:R-EU_: RESISTOR, European symbol
S1 = SparkFun:TAC_SWITCH: Momentary Switch Button commonly used for reset or general input. Spark Fun Electronics SKU : COM-00097
U$1 U$2 = tps51222:TPS51222RTVT
U$3 = tonu:TPS54332
U$4 = max785csa:MAX765CSA
U$101-U$108 = tonu:IRF8252
X1 = con-phoenix-508:MST2V: PHOENIX
X2 = SparkFun:USB: USB Connectors USB-B-PTH is fully proven SKU : PRT-00139 USB-miniB is fully proven SKU : PRT-00587 USB-A-PCB is untested. USB-A-H is throughly reviewed, but untested. Spark Fun Electronics SKU : PRT-00437 USB-B-SMT is throughly reviewed, but untested. Needs silkscreen touching up. USB-A-S has not been used/tested USB-MB-H has not been used/tested
Y1 = murata-filter:CSTCR: Resonator Source: murata.co.jp

## Net classes
0 default: width 0.152 mm, drill 0.152 mm, clearance 0.152 mm
1 power: width 1.905 mm, drill 0.508 mm, clearance 0.66 mm
2 somepower: width 0.508 mm, drill 0.305 mm, clearance 0.254 mm